# EAGLE design wheatstone (EAGLE 9.6.0)
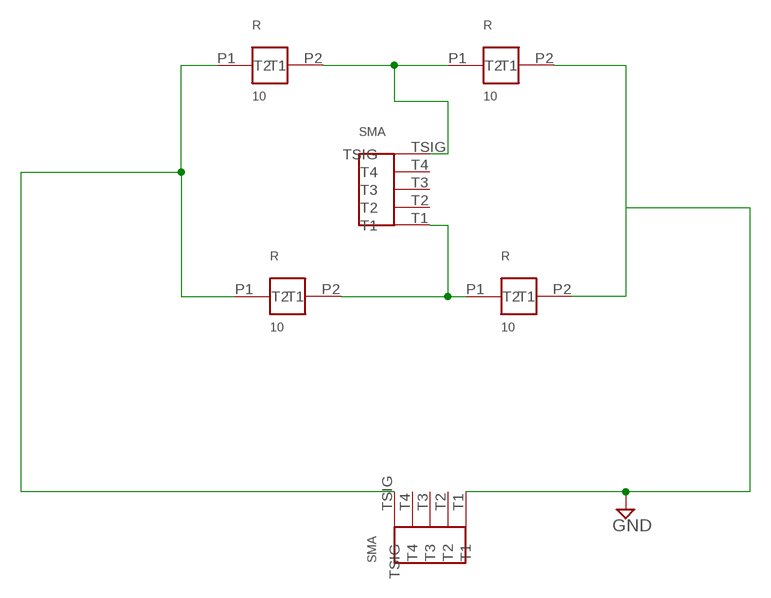
[diagram p0: schematic, sheet 1]

## Parts
U$1  0404RESISTORS  [0404RESISTORS]
U$2  0404RESISTORS  [0404RESISTORS]
U$3  0404RESISTORS  [0404RESISTORS]
U$4  0404RESISTORS  [0404RESISTORS]
U$5  TC  [TC]
U$6  TC  [TC]

## Nets
GND: U$2.P2(T2) U$4.P2(T2) U$6.T1
N$1: U$1.P1(T1) U$3.P1(T1) U$6.TSIG
N$2: U$1.P2(T2) U$2.P1(T1) U$5.TSIG
N$3: U$3.P2(T2) U$4.P1(T1) U$5.T1
Unconnected: U$5.T2 U$5.T3 U$5.T4 U$6.T2 U$6.T3 U$6.T4

## Library data of the parts
U$1-U$4 = project2:0404RESISTORS
U$5 U$6 = project2:TC

## Board
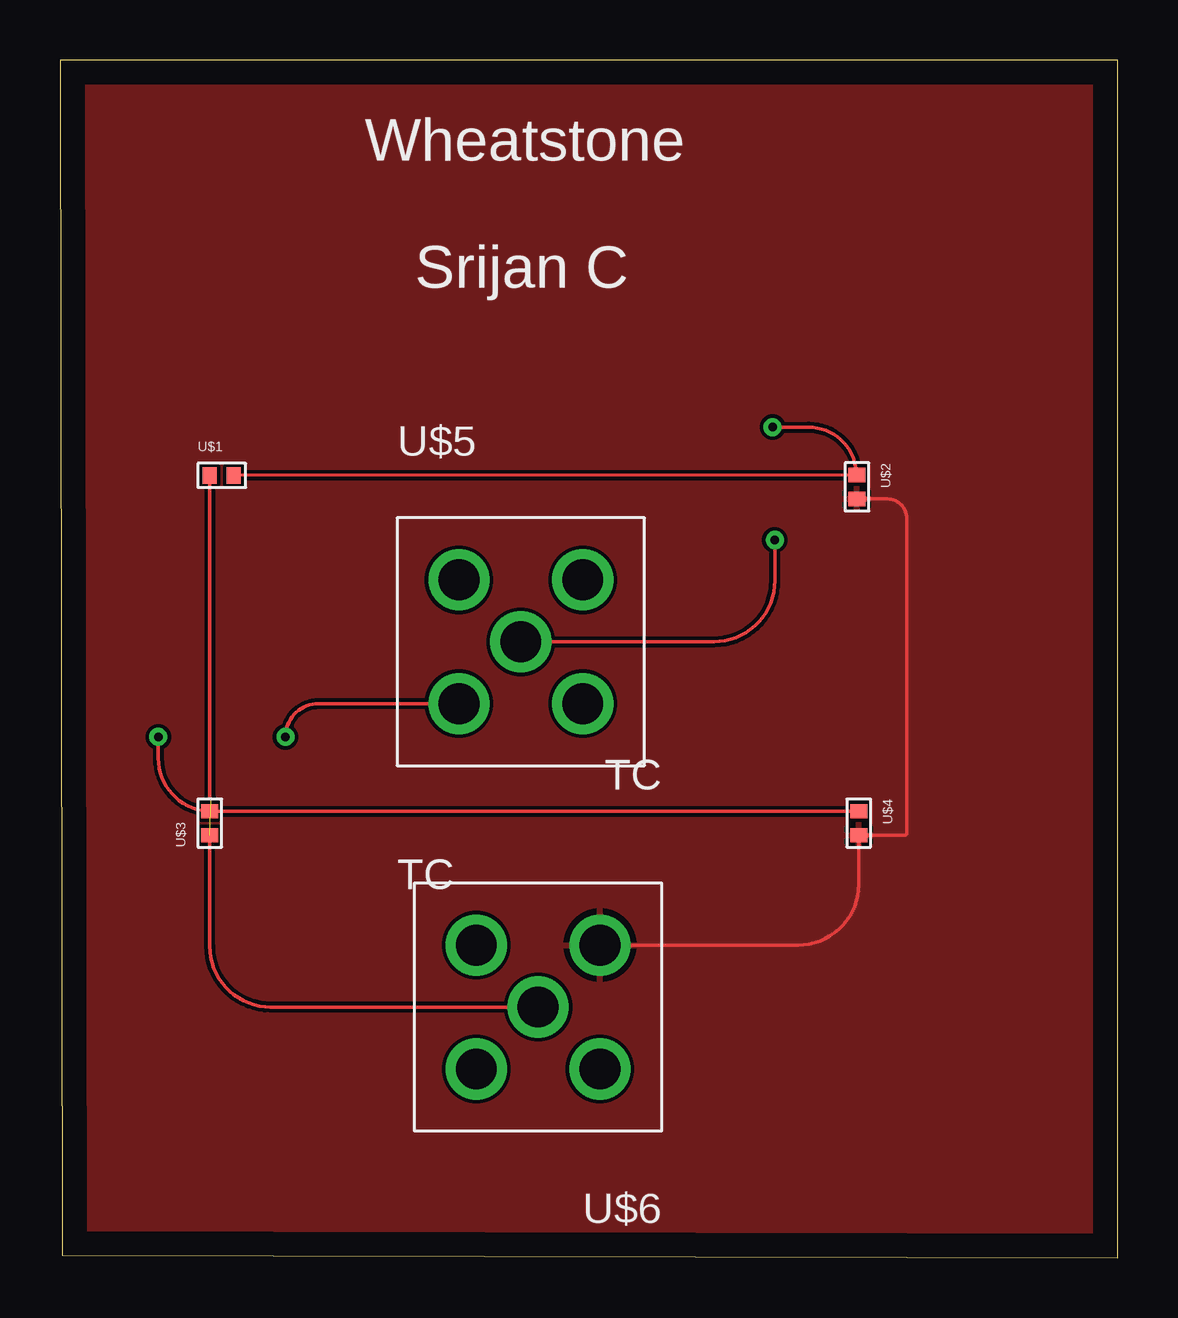
[diagram p1: board, top side]
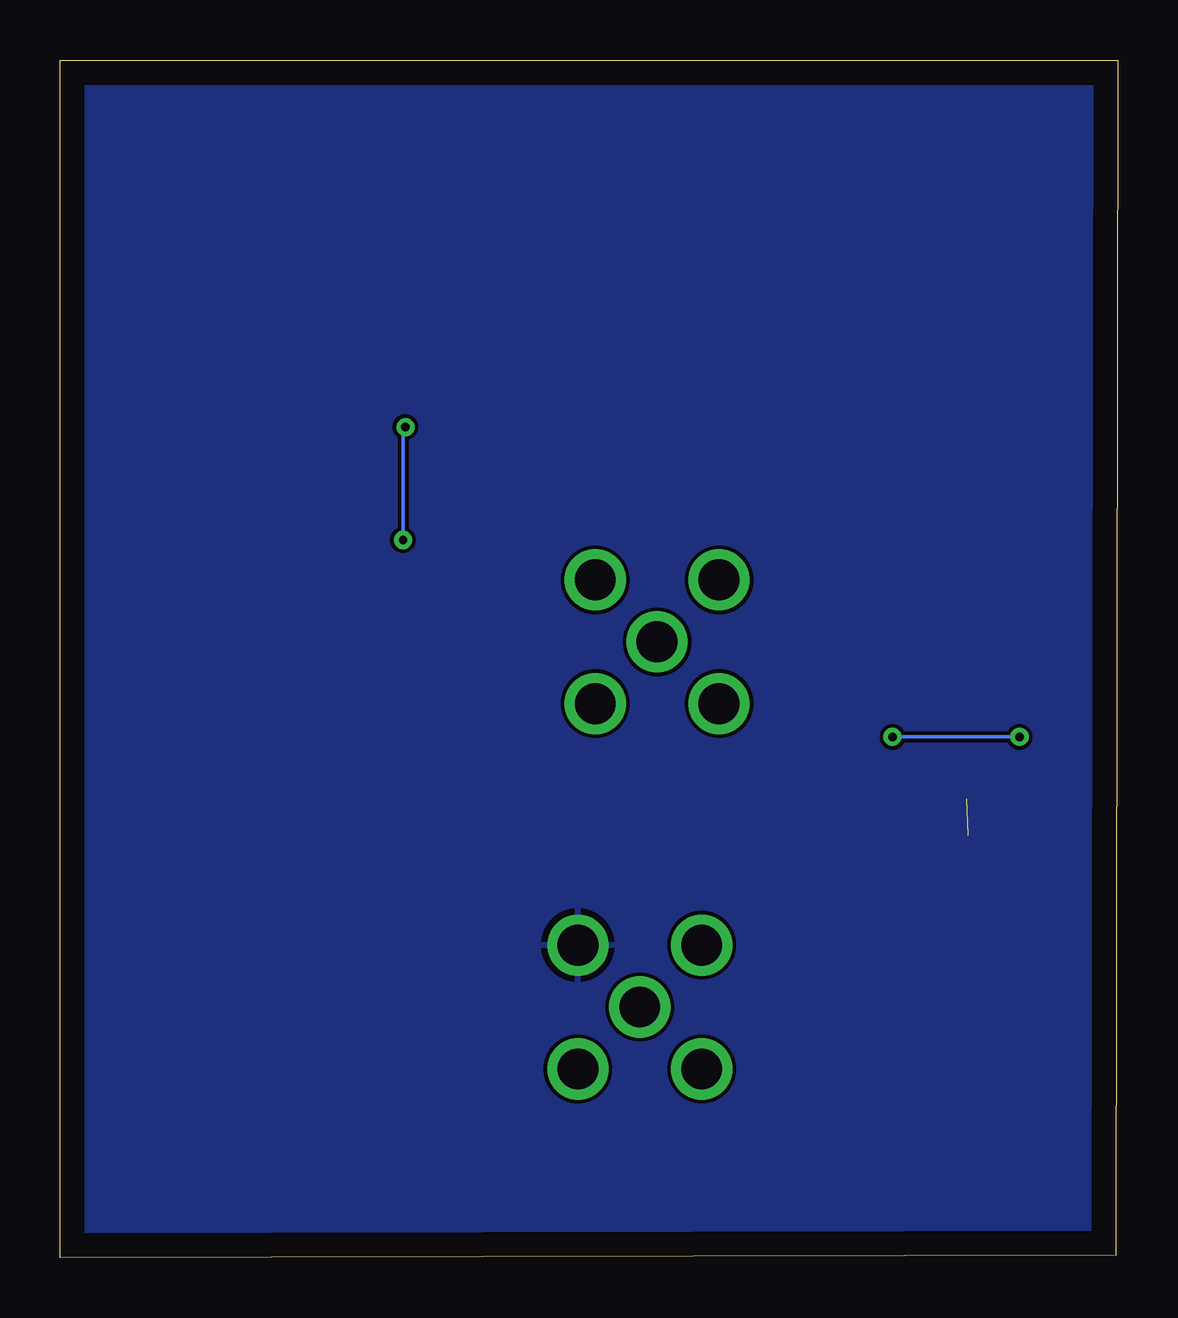
[diagram p2: board, bottom side, seen from below]

Size 44.1 x 49.9 mm. Coordinates in mm from the lower left corner, seen from the top.
Outline: 0.1,0.1 44.1,0 44.1,49.9 0,49.9 0.1,0.1
Copper layers (1*16): Top 0.035mm / dielectric 1.5mm / Bottom 0.035mm
Design rules "default": minimum track width 6mil, minimum drill 0.35mm, track to track 6mil, track to pad 6mil, pad to pad 6mil, via to via 6mil, smd to smd 6mil, copper to edge 40mil, drill to drill 6mil, minimum pad ring 10mil, minimum via ring 8mil, stop-mask expansion 4mil, vias tented up to drill 0mil, thermal gap 10mil

### Footprints (pad centres in the part's own frame; a part is rotated, then mirrored left to right if it is on the bottom)
0404RESISTORS = smd 0.6 x 0.7: P1 -0.5,0; P2 0.5,0
TC = drill 1.7: T1 -2.58,-2.58; T2 2.58,-2.58; T3 2.58,2.58; T4 -2.58,2.58; TSIG 0,0

### Placement (x,y rotation side)
U$1  6.74,32.59 0 top
U$2  33.22,32.11 270 top
U$3  6.24,18.1 90 top
U$4  33.3,18.1 270 top
U$5  19.21,25.66 0 top
U$6  19.93,10.44 180 top

### Tracks (layer width: path | path; a pad name or v marks a point on that pad's centre or on a via)
GND
  Top 0.152: U$2.P2 34.49,31.61 arc-90 35.3,30.8 35.3,17.7 arc-90 35.2,17.6 U$4.P2 33.3,15.56 arc-90 30.76,13.02 U$6.T1
  pour Top: 0,49.9 0,0 0.2,0 44.3,0 44.3,49.9
  pour Bottom: 0,49.9 0,0.1 12.3,0.1 44.2,0.1 44.2,43.1 44.2,49.9
N$1  (1 unrouted)
  Top 0.152: U$1.P1 6.24,19.19 6.3,19.13 | U$6.TSIG 8.78,10.44 arc-90 6.24,12.98 U$3.P1
N$2  (via drill 0.35)
  Top 0.152: U$1.P2 33.2,32.61 | 33.2,32.61 U$2.P1 | U$5.TSIG 27.26,25.66 arc90 29.8,28.2 v29.8,29.9 | v29.7,34.6 31.21,34.6 arc-90 33.2,32.61
  Bottom 0.152: v29.7,34.6 arc-90 29.8,34.5 v29.8,29.9
N$3  (via drill 0.35)
  Top 0.152: U$3.P2 6.3,18.6 | 6.3,18.6 U$4.P1 | U$5.T1 10.78,23.08 arc90 v9.4,21.7 | v4.1,21.7 4.1,20.8 arc90 6.3,18.6
  Bottom 0.152: v9.4,21.7 v4.1,21.7

### Text on the board
tNames: Wheatstone | Srijan C